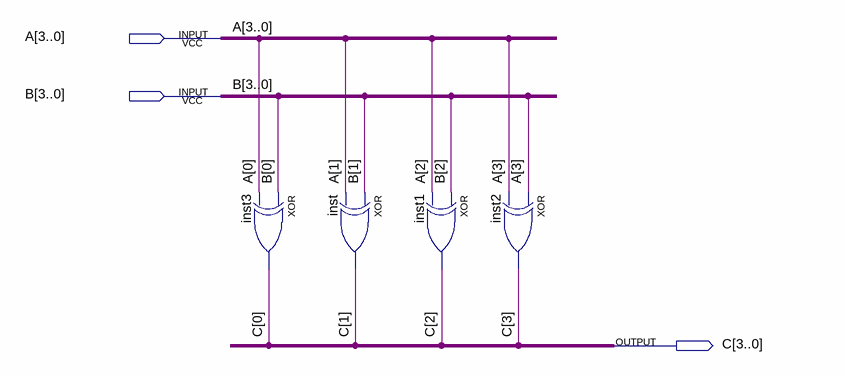
[diagram p0: schematic sheet]
// Quartus schematic AxorB.bdf as structural Verilog: 4 symbols, 3 pins
module AxorB (
  input  [3:0] A,
  input  [3:0] B,
  output [3:0] C
);

  xor inst3 (C[0], B[0], A[0]);
  xor inst (C[1], B[1], A[1]);
  xor inst1 (C[2], B[2], A[2]);
  xor inst2 (C[3], A[3], A[3]);
endmodule
